# EasyEDA Pro project dpbv3_schematic.epro

# Schematic Schematic1
Board Name: Board1; Create Date: 2025-01-31; Page Name: P1; Project Name: New Project_2025-01-31_11-25-02; Schematic Name: Schematic1; Update Date: 2025-01-31; Company: EasyEDA.com; Page Size: A4; Version: V1.0
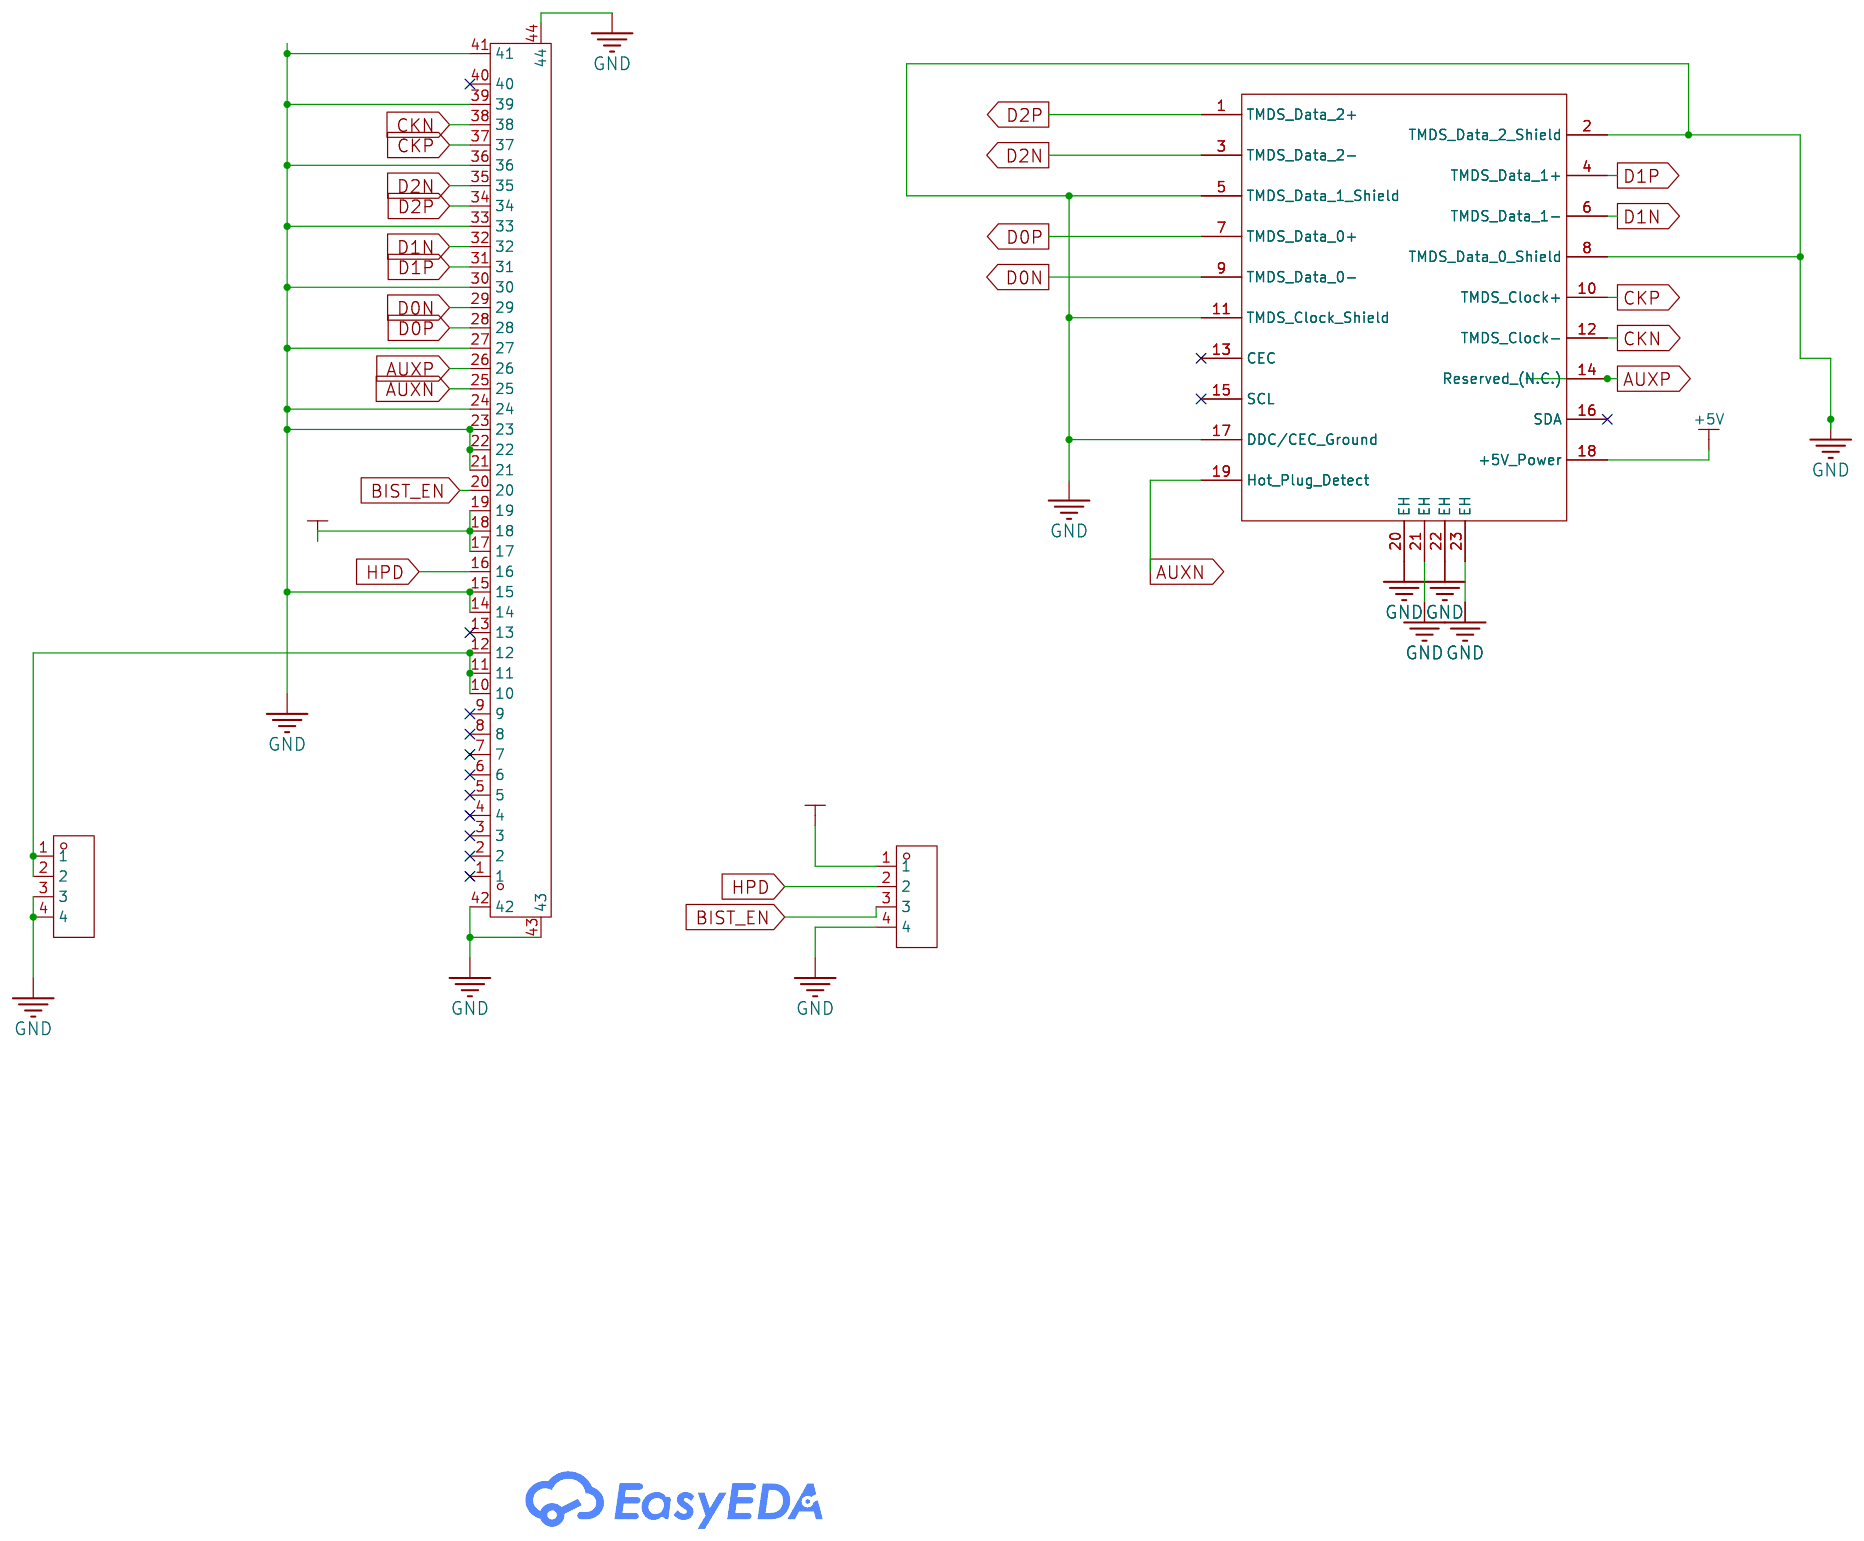
[diagram p0: schematic sheet]

## Parts
CN1  20455-040E-76  [CONN-SMD_40P-P-0.50_20455-040E-76]
CN2  HYC109-HDMIA19-160  [HDMI-SMD_HYC109-HDMIA19-160]
H1  PZ254V-11-04P  [HDR-TH_4P-P2.54-V-M]
H2  PZ254V-11-04P  [HDR-TH_4P-P2.54-V-M]

## Library data of the parts
CN1 = 20455-040E-76: Locking Feature:- Contact Type:Contact,Top Number of Contacts:40P Pitch:0.5mm Mounting Type:Horizontal attachment FFC, FCB Thickness:- FFC, FCB Thickness:- Height Above Board:1mm Contact Material:Phosphor Bronze Contact Plating:Gold Operating Temperature:; LCSC Part Name: 间距:0.5mm P数:40P 上接; Supplier Part: C5160883; Manufacturer: I-PEX(第一精工); Supplier Footprint: SMD,P=0.5mm,卧贴; JLCPCB Part Class: Extended Part; Datasheet: https://atta.szlcsc.com/upload/public/pdf/source/20240130/EF5FF667CA12454350B99650AB73E6AF.pdf; Supplier: LCSC; Contact Type: Contact,Top; Number of Contacts: 40P; Pitch: 0.5mm; Mounting Type: Horizontal attachment; Height Above Board: 1mm; Contact Material: Phosphor Bronze; Contact Plating: Gold; Operating Temperature: -40℃~+85℃
CN2 = HYC109-HDMIA19-160: Connector Type:HDMI-A Gender:公 Number of Pins:19P Mounting Style:夹板 Current Rating (Max):0.5A Rated Voltage (Max):40V Operating Temperature Range:-25℃~+85℃ Operating Temperature Range:-25℃~+85℃; Supplier Part: C711355; Manufacturer: 华宇创; Supplier Footprint: SMD; JLCPCB Part Class: Extended Part; Datasheet: https://atta.szlcsc.com/upload/public/pdf/source/20200812/C711355_A848759657FFB518783CC8260B9E2C54.pdf; Supplier: LCSC; Connector Type: HDMI-A; Gender: 公; Number of Pins: 19P; Mounting Style: 夹板; Current Rating (Max): 0.5A; Rated Voltage (Max): 40V; Operating Temperature Range: -25℃~+85℃
H1 H2 = PZ254V-11-04P: Pin Structure:1x4P Pitch:2.54mm Row Spacing:- Circluar Pins/Square Pins:Square Pins Mounting Type:Straight Number of Rows:Plugin Number of Pins:4P Current Rating (Max):3A Voltage Rating (Max):250V Length of Mating Pin:6mm Insulation Height:2.5mm Length of; LCSC Part Name: 间距:2.54mm 1x4P 直插 方针; Supplier Part: C2691448; Manufacturer: XFCN(兴飞); Supplier Footprint: 插件,P=2.54mm; JLCPCB Part Class: Extended Part; Datasheet: https://atta.szlcsc.com/upload/public/pdf/source/20200309/C492403_F9F19131791D08044AD4F84F8E751A34.pdf; Supplier: LCSC; Pin Structure: 1x4P; Pitch: 2.54mm; Circluar Pins/Square Pins: Square Pins; Mounting Type: Straight; Number of Rows: Plugin; Number of Pins: 4P; Current Rating (Max): 3A; Voltage Rating (Max): 250V; Length of Mating Pin: 6mm; Insulation Height: 2.5mm; Length of End Connection Pin: 3mm; Operating Temperature Range: -40℃~+105℃; Color: Black

## Nets
+3.3V: CN1.17 CN1.18 CN1.19 H2.1
+5V: CN2.18(+5V Power)
GND: CN1.14 CN1.15 CN1.21 CN1.22 CN1.23 CN1.24 CN1.27 CN1.30 CN1.33 CN1.36 CN1.39 CN1.41 CN1.42 CN1.43 CN1.44 CN2.2(TMDS Data 2 Shield) CN2.5(TMDS Data 1 Shield) CN2.8(TMDS Data 0 Shield) CN2.11(TMDS Clock Shield) CN2.17(DDC/CEC Ground) CN2.20(EH) CN2.21(EH) CN2.22(EH) CN2.23(EH) H1.3 H1.4 H2.4
AUXN: CN1.25 CN2.19(Hot Plug Detect)
AUXP: CN1.26 CN2.14(Reserved (N.C.))
BIST_EN: CN1.20 H2.3
CKN: CN1.38 CN2.12(TMDS Clock-)
CKP: CN1.37 CN2.10(TMDS Clock+)
D0N: CN1.29 CN2.9(TMDS Data 0-)
D0P: CN1.28 CN2.7(TMDS Data 0+)
D1N: CN1.32 CN2.6(TMDS Data 1-)
D1P: CN1.31 CN2.4(TMDS Data 1+)
D2N: CN1.35 CN2.3(TMDS Data 2-)
D2P: CN1.34 CN2.1(TMDS Data 2+)
HPD: CN1.16 H2.2
Net-(CN1-10): CN1.10 CN1.11 CN1.12 H1.1 H1.2

Not connected (* = marked no-connect by the designer): CN1 1* 2* 3* 4* 5* 6* 7* 8* 9* 13* 40*; CN2 13(CEC)* 15(SCL)* 16(SDA)*
